# Altium schematic sheet ST7789_Sheet.SchDoc
size A4
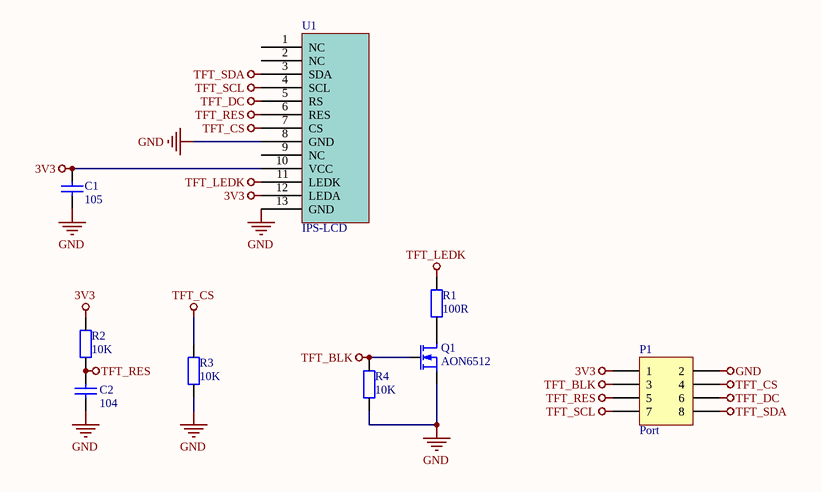
[diagram p0: ST7789_Sheet.SchDoc]

## Parts
C1  105  [电容_C0603]
C2  104  [电容_C0603]
P1  Port  [HDR2X4]
Q1  AON6512  [MOS_SOT-23]
R1  100R  [电阻_R0603]
R2  10K  [电阻_R0603]
R3  10K  [电阻_R0603]
R4  10K  [电阻_R0603]
U1  IPS-LCD  [1.14IPS-LCD]

## Nets
3V3: C1.2 P1.1 R2.2 U1.10(VCC) U1.12(LEDA)
GND: C1.1 C2.1 P1.2 Q1.3(S) R3.1 R4.1 U1.8(GND) U1.13(GND)
TFT_BLK: P1.3 Q1.1(G) R4.2
TFT_CS: P1.4 R3.2 U1.7(CS)
TFT_DC: P1.6 U1.5(RS)
TFT_LEDK: R1.2 U1.11(LEDK)
TFT_RES: C2.2 P1.5 R2.1 U1.6(RES)
TFT_SCL: P1.7 U1.4(SCL)
TFT_SDA: P1.8 U1.3(SDA)
NetQ1_2: Q1.2(D) R1.1

Not connected (* = marked no-connect by the designer): U1 1(NC) 2(NC) 9(NC)

## Library data of the parts
C1 C2 = cap: U: 50V; 参数: Cap,0805,X7R,104K,50V,125C,±10%
  C1: C: 105
  C2: C: 104
P1 = Header 4X2: Header, 4-Pin, Dual row; LatestRevisionDate: 17-Jul-2002; LatestRevisionNote: Re-released for DXP Platform.; Publisher: Altium Limited
Q1 = MOSFET-N: 参数: N-MOSFET,DFN5*6,AON6512,30V,150A
R1 = Res: _Accuracy: 1%; _Power: 1/8W; _Footprint: 0805; _Drift: 100ppm; _Comma: ,; _Specification: Res,0805,100R,1%,1/8W,100ppm; _Name: Res; _Value: 100R
R2-R4 = Res: P: 1/8W; 参数: Res,0805,0R,±1%,1/8W,100ppm,155C; R: 10K
U1 = IPS-LCD-1.14: IPS-LCD-1.14寸裸屏spi接口